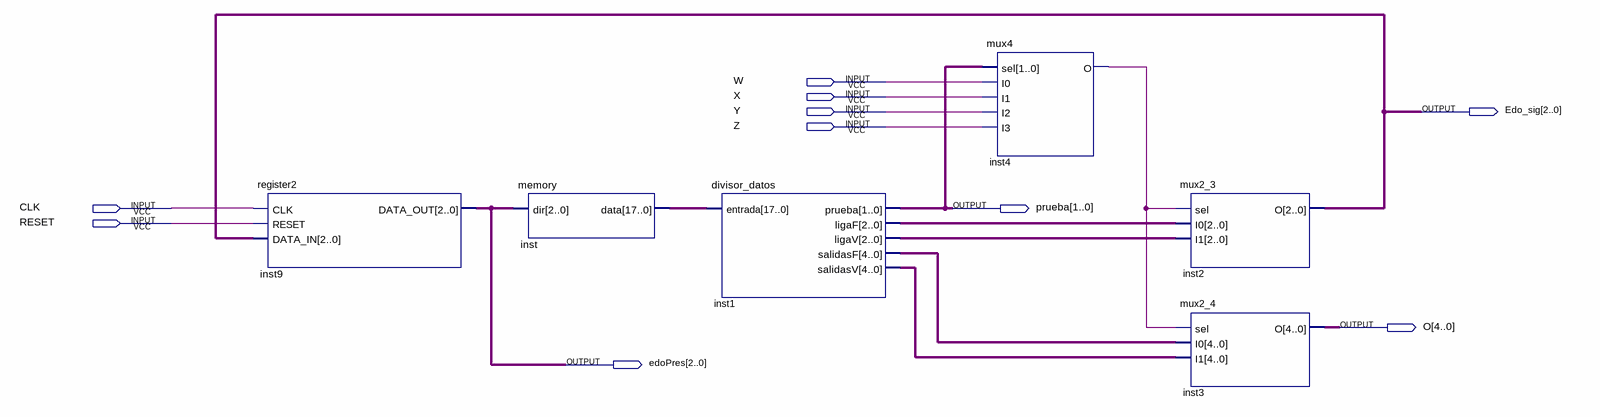
[diagram p0: schematic sheet]
// Quartus schematic practica4.bdf as structural Verilog: 6 symbols, 10 pins
module practica4 (
  input  W,
  input  X,
  input  Y,
  input  Z,
  input  CLK,
  input  RESET,
  output [2:0] Edo_sig,
  output [1:0] prueba,
  output [4:0] O,
  output [2:0] edoPres
);

  wire inst4_o;
  wire [2:0] inst1_ligaf, inst1_ligav;
  wire [4:0] inst1_salidasf, inst1_salidasv;
  wire [17:0] inst_data;

  register2 inst9 (.CLK(CLK), .RESET(RESET), .DATA_IN(Edo_sig), .DATA_OUT(edoPres));
  memory inst (.dir(edoPres), .data(inst_data));
  divisor_datos inst1 (
    .entrada(inst_data), .prueba(prueba), .ligaF(inst1_ligaf), .ligaV(inst1_ligav),
    .salidasF(inst1_salidasf), .salidasV(inst1_salidasv));
  mux4 inst4 (.sel(prueba), .I0(W), .I1(X), .I2(Y), .I3(Z), .O(inst4_o));
  mux2_3 inst2 (.sel(inst4_o), .I0(inst1_ligaf), .I1(inst1_ligav), .O(Edo_sig));
  mux2_4 inst3 (.sel(inst4_o), .I0(inst1_salidasf), .I1(inst1_salidasv), .O(O));
endmodule
